# Altium schematic sheet HMC5883_module.SchDoc
size A2
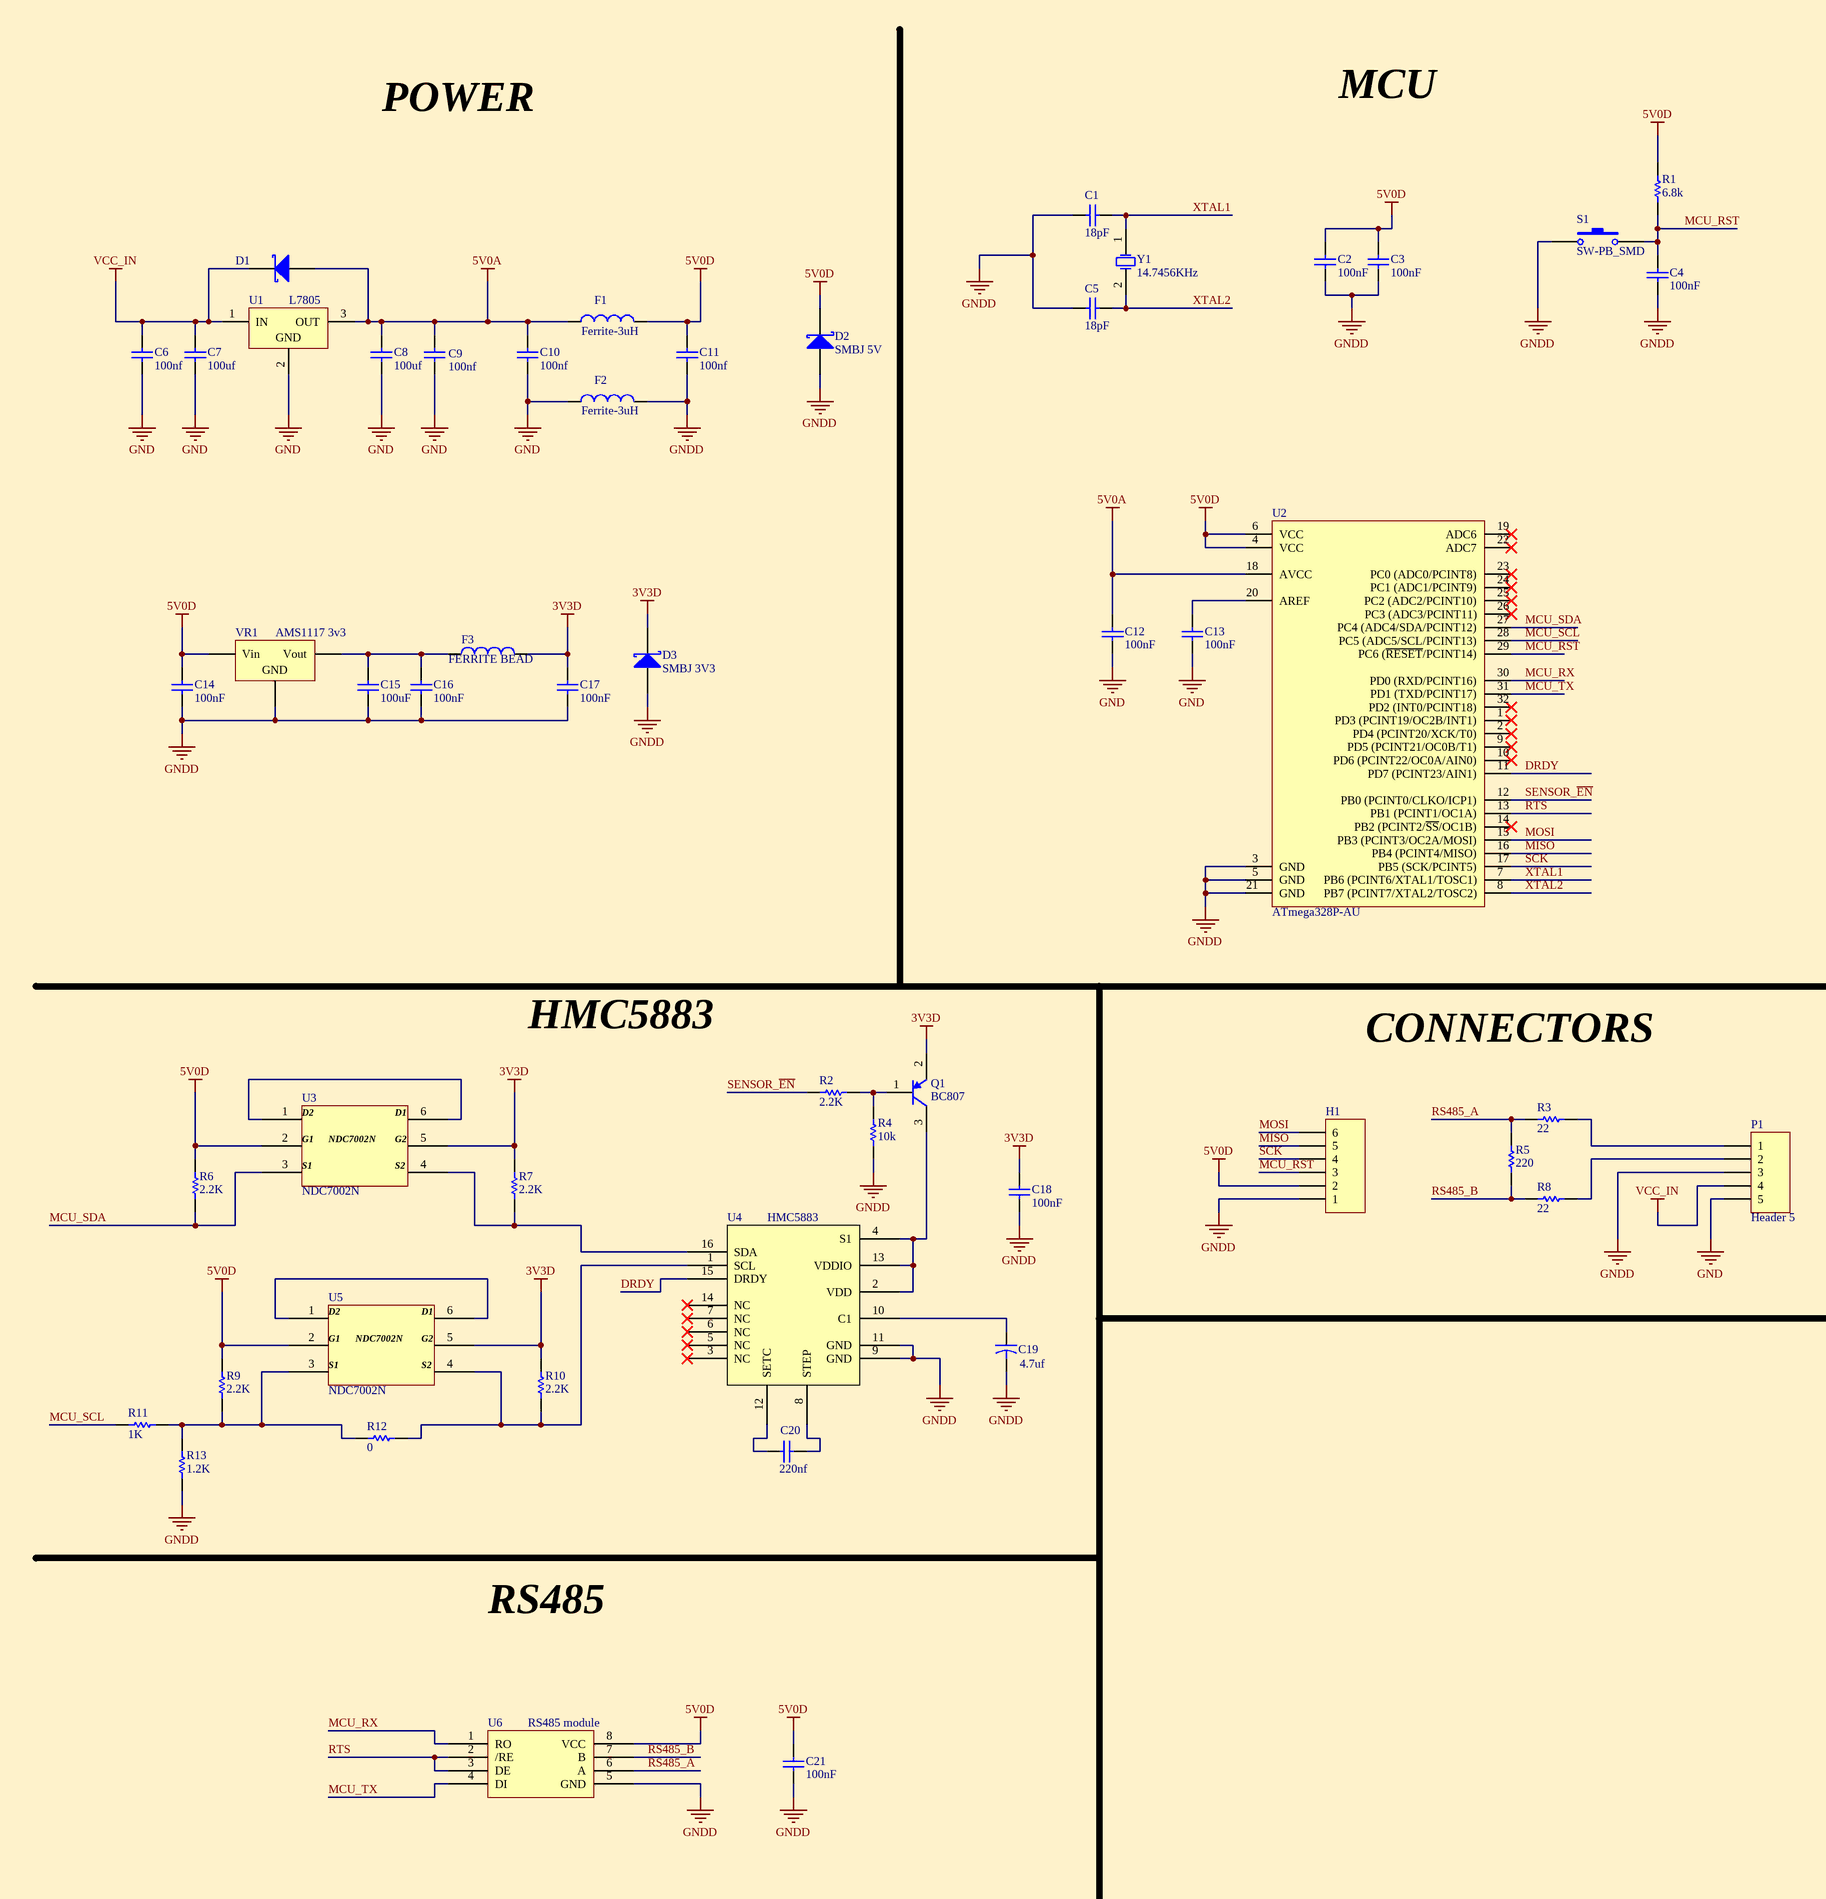
[diagram p0: HMC5883_module.SchDoc, left]
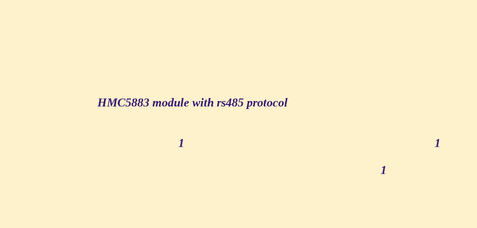
[diagram p1: HMC5883_module.SchDoc, right]

## Parts
C1  18pF  [1206]
C2  100nF  [1206]
C3  100nF  [1206]
C4  100nF  [1206]
C5  18pF  [1206]
C6  100nf  [1206]
C7  100uf  [1206]
C8  100uf  [1206]
C9  100nf  [1206]
C10  100nf  [1206]
C11  100nf  [1206]
C12  100nF  [1206]
C13  100nF  [1206]
C14  value 100nF  [1206]  (hidden comment: Cap)
C15  value 100uF  [1206]  (hidden comment: Cap)
C16  value 100nF  [1206]  (hidden comment: Cap)
C17  value 100nF  [1206]  (hidden comment: Cap)
C18  value 100nF  [1206]  (hidden comment: Cap)
C19  value 4.7uf  [CAP_SMD_A]  (hidden comment: Cap2)
C20  value 220nf  [1206]  (hidden comment: Cap)
C21  value 100nF  [1206]  (hidden comment: Cap)
D1  D Schottky  [ZINER]  (value not drawn)
D2  SMBJ 5V  [TVS]
D3  SMBJ 3V3  [TVS]
F1  Ferrite-3uH  [1206]
F2  Ferrite-3uH  [1206]
F3  FERRITE BEAD  [1206]
H1  White SMD Connector 6pin  [White SMD Connector 6pin B]  (value not drawn)
P1  Header 5  [HDR1X5]
Q1  BC807  [SOT-23]
R1  6.8k  [1206]
R2  2.2K  [1206]
R3  22  [1206]
R4  10k  [1206]
R5  220  [1206]
R6  2.2K  [1206]
R7  2.2K  [1206]
R8  22  [1206]
R9  2.2K  [1206]
R10  2.2K  [1206]
R11  1K  [1206]
R12  0  [1206]
R13  1.2K  [1206]
S1  SW-PB_SMD  [PB4x3.2]
U1  L7805  [DPAK]
U2  ATmega328P-AU  [32A_L]
U3  NDC7002N  [SOP6]
U4  HMC5883  [LCC16]
U5  NDC7002N  [SOP6]
U6  RS485 module  [SOP8]
VR1  AMS1117 3v3  [LD1117]
Y1  14.7456KHz  [XTAL_SMD]

## Nets
3V3D: C17.2 C18.2 D3.1(K) F3.2 Q1.2(E) R7.2 R10.2 U3.5 U5.5
5V0A: C8.2 C9.2 C10.2 C12.2 D1.1(A) F1.1 U1.3(OUT) U2.18(AVCC)
5V0D: C2.2 C3.2 C11.2 C14.2 C21.2 D2.1(K) F1.2 H1.2 R1.1 R6.2 R9.2 U2.4(VCC) U2.6(VCC) U3.2 U5.2 U6.8(VCC) VR1.3(Vin)
GND: C6.1 C7.1 C8.1 C9.1 C10.1 C12.1 C13.1 F2.1 P1.5 U1.2(GND)
GNDD: C1.1 C2.1 C3.1 C4.1 C5.1 C11.1 C14.1 C15.1 C16.1 C17.1 C18.1 C19.2 C21.1 D2.2(A) D3.2(A) F2.2 H1.1 P1.3 R4.2 R13.2 S1.1 U2.3(GND) U2.5(GND) U2.21(GND) U4.9(GND) U4.11(GND) U6.5(GND) VR1.1(GND)
VCC_IN: C6.2 C7.2 D1.2(K) P1.4 U1.1(IN)
DRDY: U2.11(PD7_(PCINT23/AIN1)) U4.15(DRDY)
MCU_RST: C4.2 H1.3 R1.2 S1.2 U2.29(PC6_(~{RESET}/PCINT14))
MCU_RX: U2.30(PD0_(RXD/PCINT16)) U6.1(RO)
MCU_SCL: R11.1 U2.28(PC5_(ADC5/SCL/PCINT13))
MCU_SDA: R6.1 U2.27(PC4_(ADC4/SDA/PCINT12)) U3.3
MCU_TX: U2.31(PD1_(TXD/PCINT17)) U6.4(DI)
MISO: H1.5 U2.16(PB4_(PCINT4/MISO))
MOSI: H1.6 U2.15(PB3_(PCINT3/OC2A/MOSI))
RS485_A: R3.1 R5.1 U6.6(A)
RS485_B: R5.2 R8.1 U6.7(B)
RTS: U2.13(PB1_(PCINT1/OC1A)) U6.2(/RE) U6.3(DE)
SCK: H1.4 U2.17(PB5_(SCK/PCINT5))
SENSOR_~{EN}: R2.2 U2.12(PB0_(PCINT0/CLKO/ICP1))
XTAL1: C1.2 U2.7(PB6_(PCINT6/XTAL1/TOSC1)) Y1.1(OSC1)
XTAL2: C5.2 U2.8(PB7_(PCINT7/XTAL2/TOSC2)) Y1.2(OSC2)
NetC13_2: C13.2 U2.20(AREF)
NetC15_2: C15.2 C16.2 F3.1 VR1.2(Vout)
NetC19_1: C19.1 U4.10(C1)
NetC20_1: C20.1 U4.8(STEP)
NetC20_2: C20.2 U4.12(SETC)
NetP1_1: P1.1 R3.2
NetP1_2: P1.2 R8.2
NetQ1_1: Q1.1(B) R2.1 R4.1
NetQ1_3: Q1.3(C) U4.2(VDD) U4.4(S1) U4.13(VDDIO)
NetR7_1: R7.1 U3.4 U4.16(SDA)
NetR9_1: R9.1 R11.2 R12.1 R13.1 U5.3
NetR10_1: R10.1 R12.2 U4.1(SCL) U5.4
NetU3_1: U3.1 U3.6
NetU5_1: U5.1 U5.6

Not connected (* = marked no-connect by the designer): U2 1(PD3_(PCINT19/OC2B/INT1))* 2(PD4_(PCINT20/XCK/T0))* 9(PD5_(PCINT21/OC0B/T1))* 10(PD6_(PCINT22/OC0A/AIN0))* 14(PB2_(PCINT2/~{SS}/OC1B))* 19(ADC6)* 22(ADC7)* 23(PC0_(ADC0/PCINT8))* 24(PC1_(ADC1/PCINT9))* 25(PC2_(ADC2/PCINT10))* 26(PC3_(ADC3/PCINT11))* 32(PD2_(INT0/PCINT18))*; U4 3(NC)* 5(NC)* 6(NC)* 7(NC)* 14(NC)*

## Notes on the sheet
- MCU
- POWER
- HMC5883
- CONNECTORS
- RS485
- HMC5883 module with rs485 protocol
- 1
- (in symbol NDC7002N) D2; D1; G1; G2; S1; S2

## Library data of the parts
C1-C5 C12-C18 C20 C21 = Cap: Capacitor; Published: 8-Jun-2000; LatestRevisionDate: 17-Jul-2002; LatestRevisionNote: Re-released for DXP Platform.; PackageReference: RAD-0.3; Publisher: Altium Limited
  C1 C5: Value: 18pF
  C2-C4 C12 C13: Value: 100nF
C6-C11 = Cap: Capacitor, 1206; Published: 8-Jun-2000; LatestRevisionDate: 17-Jul-2002; LatestRevisionNote: Re-released for DXP Platform.; PackageReference: RAD-0.3; Publisher: Altium Limited
  C6 C9-C11: Value: 100nf
  C7 C8: Value: 100uf
C19 = Cap2: TAN; Published: 23-Sep-2002; PackageReference: CAPR5-4X5; Publisher: Altium Limited
D1 = D Schottky: Schottky Diode, 1N4148; Published: 8-Jun-2000; LatestRevisionDate: 17-Jul-2002; LatestRevisionNote: Re-released for DXP Platform.; PackageReference: SMB; Publisher: Altium Limited; Code_JEDEC: DO-214-AA
D2 = Diode 18TQ045: Schottky Rectifier; Note: Terminal 2 is the TAB and is electrically connected to the cathode; Published: 8-Jun-2000; LatestRevisionDate: 17-Jul-2002; LatestRevisionNote: Re-released for DXP Platform.; DatasheetVersion: Dec-1997; PackageVersion: Feb-1998; PackageReference: TO-220AC; Publisher: Altium Limited; ComponentLink1Description: Manufacturer Link; ComponentLink1URL: http://www.irf.com/; ComponentLink2Description: Datasheet; ComponentLink2URL: http://www.irf.com/product-info/datasheets/data/18tq.pdf
D3 = Diode 18TQ045: TVS; Note: Terminal 2 is the TAB and is electrically connected to the cathode; Published: 8-Jun-2000; LatestRevisionDate: 17-Jul-2002; LatestRevisionNote: Re-released for DXP Platform.; DatasheetVersion: Dec-1997; PackageVersion: Feb-1998; PackageReference: TO-220AC; Publisher: Altium Limited; ComponentLink1Description: Manufacturer Link; ComponentLink1URL: http://www.irf.com/; ComponentLink2Description: Datasheet; ComponentLink2URL: http://www.irf.com/product-info/datasheets/data/18tq.pdf
F1-F3 = Inductor: Code_IEC: 1005; Published: 8-Jun-2000; LatestRevisionDate: 29-May-2009; LatestRevisionNote: IPC-7351 Footprint Added.; PackageReference: 0402-A; Publisher: Altium Limited; PackageDescription: Chip Inductor; Code_JEITA: 0402
H1 = Header 6: LatestRevisionDate: 17-Jul-2002; LatestRevisionNote: Re-released for DXP Platform.; Publisher: Altium Limited
P1 = Header 5: Header, 5-Pin; LatestRevisionDate: 17-Jul-2002; LatestRevisionNote: Re-released for DXP Platform.; Publisher: Altium Limited
Q1 = 2N3906: PNP General Purpose Amplifier; Published: 8-Jun-2000; LatestRevisionDate: 15-Jan-2003; LatestRevisionNote: PCB Footprint 'BCY-W3/D4.7' replaced; DatasheetVersion: 1997; PackageVersion: Sep-1998; PackageReference: TO-92A; Publisher: Altium Limited; PackageDescription: TO, Flat Index; 3 In-Line, Axial Leads; Body Dia. 4.5mm; Leads 0.51 x 0.48 mm (max); ComponentLink1Description: Manufacturer Link; ComponentLink1URL: http://www.fairchildsemi.com/; ComponentLink2Description: Datasheet; ComponentLink2URL: http://www.fairchildsemi.com/ds/2N%2F2N3906.pdf
R1 = Res1: Resistor, 6.8k; Published: 8-Jun-2000; LatestRevisionDate: 17-Jul-2002; LatestRevisionNote: Re-released for DXP Platform.; PackageReference: AXIAL-0.3; Publisher: Altium Limited; Value: 6.8k
R2-R13 = Res1: Resistor; Published: 8-Jun-2000; LatestRevisionDate: 17-Jul-2002; LatestRevisionNote: Re-released for DXP Platform.; PackageReference: AXIAL-0.3; Publisher: Altium Limited
  R2 R6 R7 R9 R10: Value: 2.2K
  R3 R8: Value: 22
  R4: Value: 10k
  R5: Value: 220
  R11: Value: 1K
  R12: Value: 0
  R13: Value: 1.2K
S1 = SW-PB: Switch; Published: 24-Mar-1999; LatestRevisionDate: 17-Jul-2002; LatestRevisionNote: Re-released for DXP Platform.; PackageReference: SPST-2; Publisher: Altium Limited
U1 = L7805CD2T: Positive Voltage Regulator; Published: 24-Aug-2001; LatestRevisionDate: 17-Jul-2002; LatestRevisionNote: Re-released for DXP Platform.; DatasheetVersion: Dec-1998; PackageReference: TO-263; Publisher: Altium Limited; PackageDescription: D2-PAK/TO-263-AB; 3 Leads (1 Cropped); Body 15.9 (inc. leads) x 10.4 mm (LxW max); ComponentLink1Description: Manufacturer Link; ComponentLink1URL: http://www.st.com/
U2 = ATmega328P-AU: 8-bit AVR Microcontroller, 32KB Flash, 1KB EEPROM, 2KB SRAM, 32-pin TQFP, Industrial Grade (-40°C to 85°C); Published: 1-Apr-2010; DatasheetVersion: revA, Jan-2010; PackageVersion: revB, Oct-2001; PackageReference: 32A; Publisher: Altium Limited; PackageDescription: 32-Lead, 7x7x1.0 mm Body, 0.8mm Lead Pitch, Thin Profile Plastic Quad Flat Package (TQFP); Supplier 1: Digi-Key; Supplier Part Number 1: ATMEGA328P-AU-ND; Supplier 2: Farnell; Supplier Part Number 2: 1715486; Supplier 3: Mouser; Supplier Part Number 3: 556-ATMEGA328P-AU; Code_JEDEC: MS-026-ABA; ComponentLink1Description: Manufacturer Link; ComponentLink1URL: http://www.atmel.com/products/avr/default.asp?; ComponentLink2Description: ATmega48A/48PA/88A/88PA/168A/168PA/328/328P Datasheet; ComponentLink2URL: http://www.atmel.com/dyn/resources/prod_documents/8271.pdf; ComponentLink3Description: ATmega48A/48PA/88A/88PA/168A/168PA/328/328P Summary; ComponentLink3URL: http://www.atmel.com/dyn/resources/prod_documents/8271S.pdf; ComponentLink4Description: Atmel.com Home; ComponentLink4URL: http://www.atmel.com
U6 = rs485
VR1 = Volt Reg: Voltage Regulator; Published: 24-Mar-1999; LatestRevisionDate: 29-May-2009; LatestRevisionNote: IPC-7351 Footprint Added.; PackageReference: D2PAK; Publisher: Altium Limited; PackageDescription: 3-Pin Transistor Outline Package 2.54 mm Pitch, 15.1 mm Lead Span
Y1 = XTAL: Crystal Oscillator, 14.7456KHz; Published: 8-Jun-2000; LatestRevisionDate: 17-Jul-2002; LatestRevisionNote: Re-released for DXP Platform.; PackageReference: R38; Publisher: Altium Limited